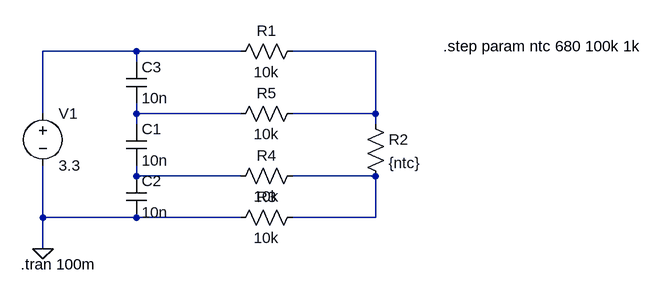
[diagram p0: schematic ntc.asc]
ntc.asc, the LTspice schematic file:
Version 4
SHEET 1 1048 680
WIRE 240 48 96 48
WIRE 400 48 240 48
WIRE 608 48 480 48
WIRE 240 64 240 48
WIRE 96 144 96 48
WIRE 240 144 240 128
WIRE 400 144 240 144
WIRE 608 144 608 48
WIRE 608 144 480 144
WIRE 240 160 240 144
WIRE 608 160 608 144
WIRE 240 240 240 224
WIRE 400 240 240 240
WIRE 608 240 480 240
WIRE 96 304 96 224
WIRE 240 304 96 304
WIRE 400 304 240 304
WIRE 608 304 608 240
WIRE 608 304 480 304
WIRE 96 352 96 304
FLAG 96 352 0
SYMBOL voltage 96 128 R0
WINDOW 123 0 0 Left 0
WINDOW 39 0 0 Left 0
SYMATTR InstName V1
SYMATTR Value 3.3
SYMBOL res 496 32 R90
WINDOW 0 0 56 VBottom 2
WINDOW 3 32 56 VTop 2
SYMATTR InstName R1
SYMATTR Value 10k
SYMBOL res 592 144 R0
SYMATTR InstName R2
SYMATTR Value {ntc}
SYMBOL cap 224 160 R0
SYMATTR InstName C1
SYMATTR Value 10n
SYMBOL res 496 288 R90
WINDOW 0 0 56 VBottom 2
WINDOW 3 32 56 VTop 2
SYMATTR InstName R3
SYMATTR Value 10k
SYMBOL res 496 224 R90
WINDOW 0 0 56 VBottom 2
WINDOW 3 32 56 VTop 2
SYMATTR InstName R4
SYMATTR Value 10k
SYMBOL res 496 128 R90
WINDOW 0 0 56 VBottom 2
WINDOW 3 32 56 VTop 2
SYMATTR InstName R5
SYMATTR Value 10k
SYMBOL cap 224 240 R0
SYMATTR InstName C2
SYMATTR Value 10n
SYMBOL cap 224 64 R0
SYMATTR InstName C3
SYMATTR Value 10n
TEXT 62 376 Left 2 !.tran 100m
TEXT 712 40 Left 2 !.step param ntc 680 100k 1k

The netlist it stands for:
* ntc.asc
V1 N001 0 3.3
R1 N002 N001 10k
R2 N002 N005 {ntc}
C1 N003 N004 10n
R3 N005 0 10k
R4 N005 N004 10k
R5 N002 N003 10k
C2 N004 0 10n
C3 N001 N003 10n
.tran 100m
.step param ntc 680 100k 1k
.backanno
.end